# EAGLE schematic SVPA-Flood_Sensor_Shield_v020 (EAGLE 6.6.0)
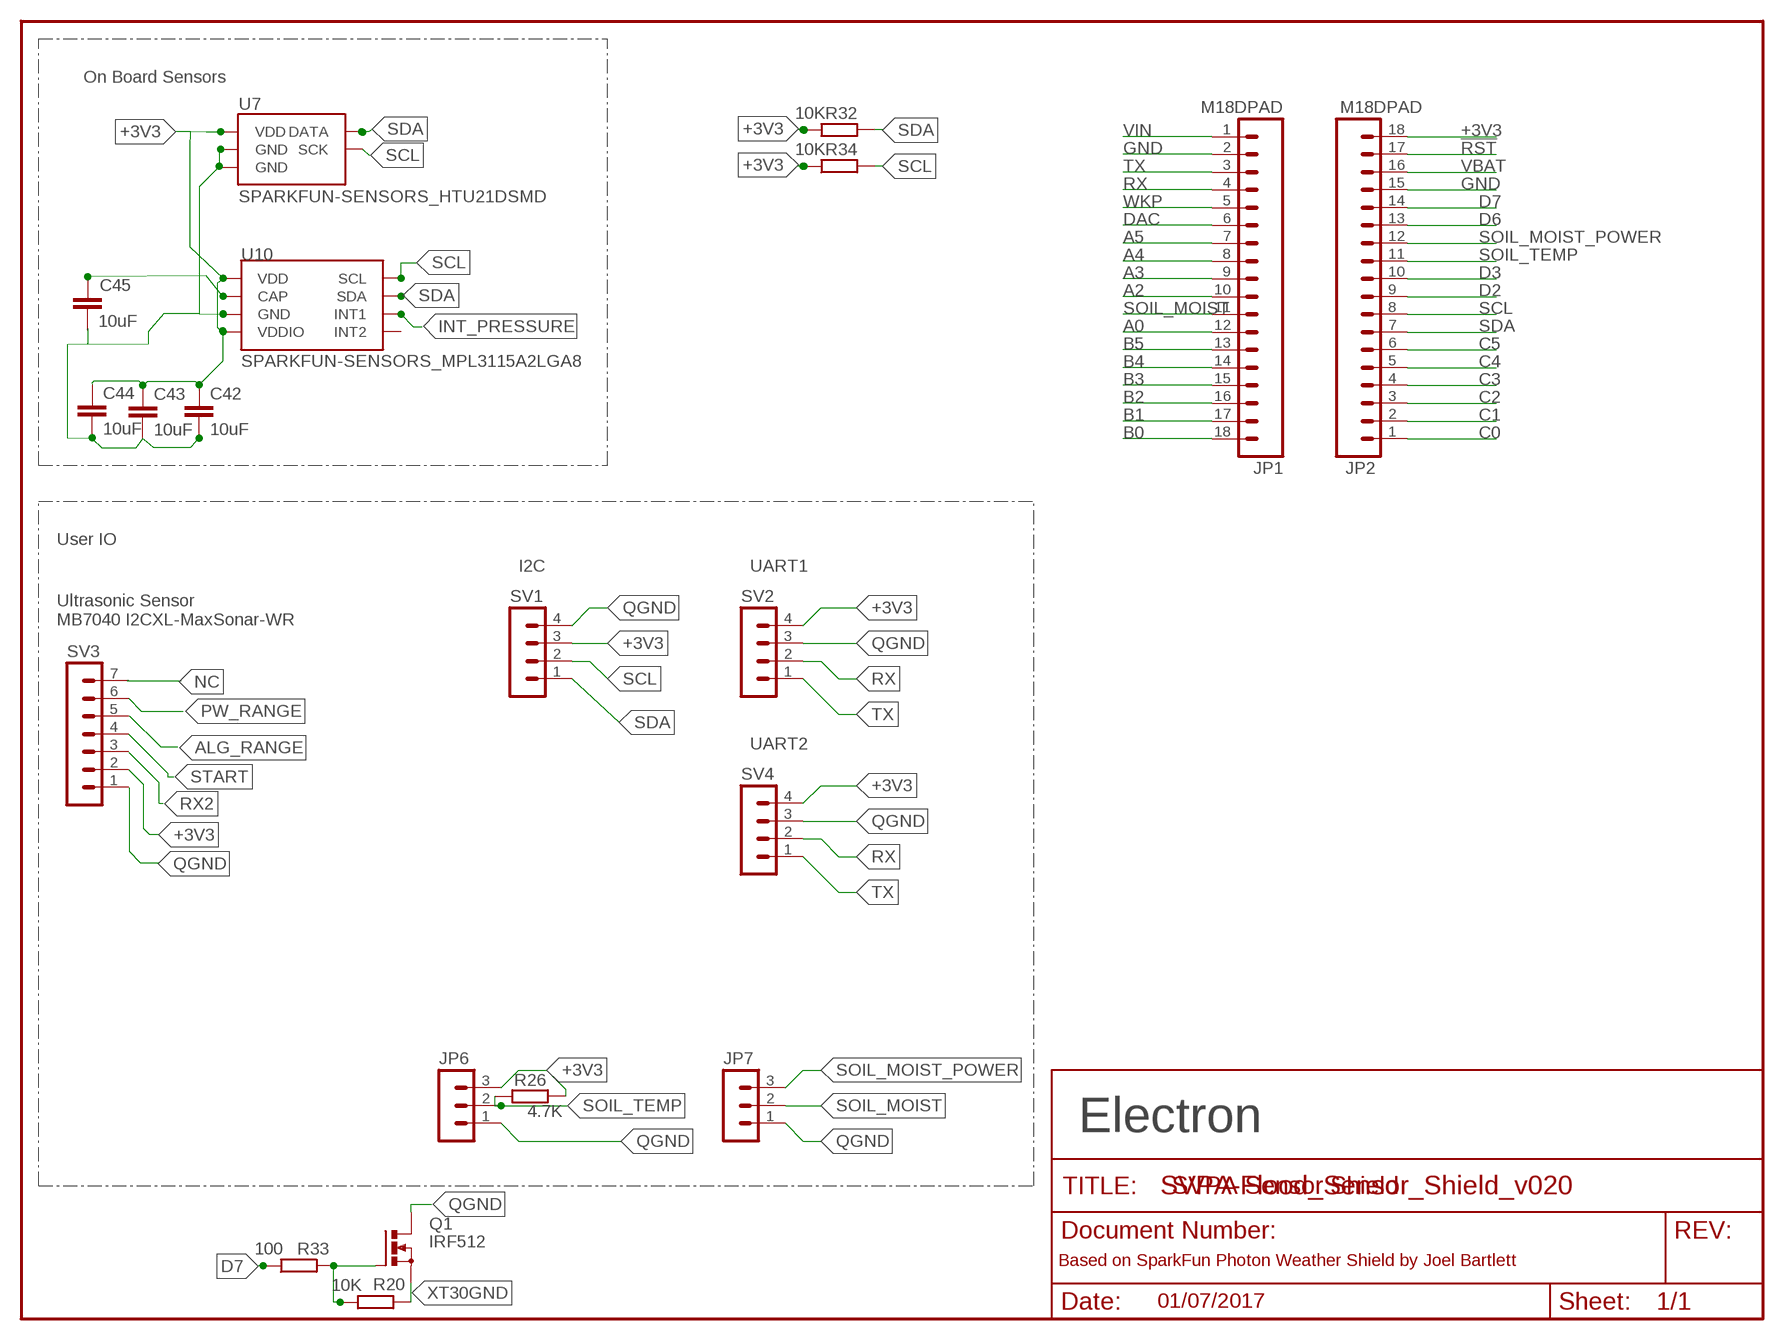
[diagram p0: schematic, sheet 1]

## Parts
C42  10uF  C-EUC0805  [C0805]
C43  10uF  C-EUC0805  [C0805]
C44  10uF  C-EUC0805  [C0805]
C45  10uF  C-EUC0805  [C0805]
JP1  M18DPAD  [1X18-D-PADS]
JP2  M18DPAD  [1X18-D-PADS]
JP6  MA03-1  [MA03-1]
JP7  MA03-1  [MA03-1]
Q1  IRF512  [TO220BV]
R20  10K  R-EU_R0805  [R0805]
R26  4.7K  R-EU_R0805  [R0805]
R32  10K  R-EU_R0805  [R0805]
R33  100  R-EU_R0805  [R0805]
R34  10K  R-EU_R0805  [R0805]
SV1  MA04-1  [MA04-1]
SV2  MA04-1  [MA04-1]
SV3  MA07-1  [MA07-1]
SV4  MA04-1  [MA04-1]
U7  SPARKFUN-SENSORS_HTU21DSMD  [SPARKFUN-SENSORS_HTU21D]
U10  SPARKFUN-SENSORS_MPL3115A2LGA8  [SPARKFUN-SENSORS_LGA8]

## Nets
!RST: JP2.17
+3V3: C42.1 C43.1 C44.1 JP2.18 JP6.3 R32.1 R34.1 SV1.3 SV2.4 SV4.4 U7.VDD U10.1(VDD) U10.4(VDDIO)
A0: JP1.12
A2: JP1.10
A3: JP1.9
A4: JP1.8
A5: JP1.7
B0: JP1.18
B1: JP1.17
B2: JP1.16
B3: JP1.15
B4: JP1.14
B5: JP1.13
C0: JP2.1
C1: JP2.2
C2: JP2.3
C3: JP2.4
C4: JP2.5
C5: JP2.6
D2: JP2.9
D3: JP2.10
D6: JP2.13
D7: JP2.14 R33.1
DAC: JP1.6
GND: JP1.2 JP2.15
INT_PRESSURE: U10.6(INT1)
N$9: C45.1 U10.2(CAP)
N$46: Q1.G R20.1 R33.2
QGND: C42.2 C43.2 C44.2 JP6.1 JP7.1 Q1.D SV1.4 SV2.3 SV4.3 U7.7(GND) U7.GND U10.3(GND)
RX: JP1.4 SV2.2 SV4.2
SCL: JP2.8 R34.2 SV1.2 U7.SCK U10.8(SCL)
SDA: JP2.7 R32.2 SV1.1 U10.7(SDA)
SOIL_MOIST: JP1.11 JP7.2
SOIL_MOIST_POWER: JP2.12 JP7.3
SOIL_TEMP: JP2.11 JP6.2
TX: JP1.3 SV2.1 SV4.1
VBAT: JP2.16
VIN [vcc]: JP1.1
WKP: JP1.5
XT30GND: Q1.S R20.2
Unconnected: C45.2 R26.1 R26.2 SV3.1 SV3.2 SV3.3 SV3.4 SV3.5 SV3.6 SV3.7 U7.DATA U10.5(INT2)

## Notes on the sheet
- On Board Sensors
- User IO
- I2C | UART1
- Ultrasonic Sensor
  MB7040 I2CXL-MaxSonar-WR
- UART2
- Electron
- SVPA Sensor Shield
- Based on SparkFun Photon Weather Shield by Joel Bartlett
- 01/07/2017

## Library data of the parts
C42-C45 = resistor:C-EU: CAPACITOR, European symbol
JP1 JP2 = Particle:M18
JP6 JP7 = con-lstb:MA03-1: PIN HEADER; OC_FARNELL: unknown; OC_NEWARK: unknown
Q1 = transistor-power:IRF512: N-CHANNEL MOS FET
R20 R26 R32-R34 = resistor:R-EU_: RESISTOR, European symbol
SV1 SV2 SV4 = con-lstb:MA04-1: PIN HEADER; OC_FARNELL: unknown; OC_NEWARK: unknown
SV3 = con-lstb:MA07-1: PIN HEADER; OC_FARNELL: unknown; OC_NEWARK: unknown
U7 = SF_sch_Photon_Weather_Shield_v10:SPARKFUN-SENSORS_HTU21D
U10 = SF_sch_Photon_Weather_Shield_v10:SPARKFUN-SENSORS_MPL3115A2: Altimeter/Pressure Sensor, I2C, 1.95V-3.6V supply, 50 to 110kPa

## Net classes
2 RF: width 0.33 mm, clearance 0.191 mm
3 BAT: clearance 0.203 mm